# Altium schematic sheet First_Sheet.SCHDOC
size 420 x 297 mm
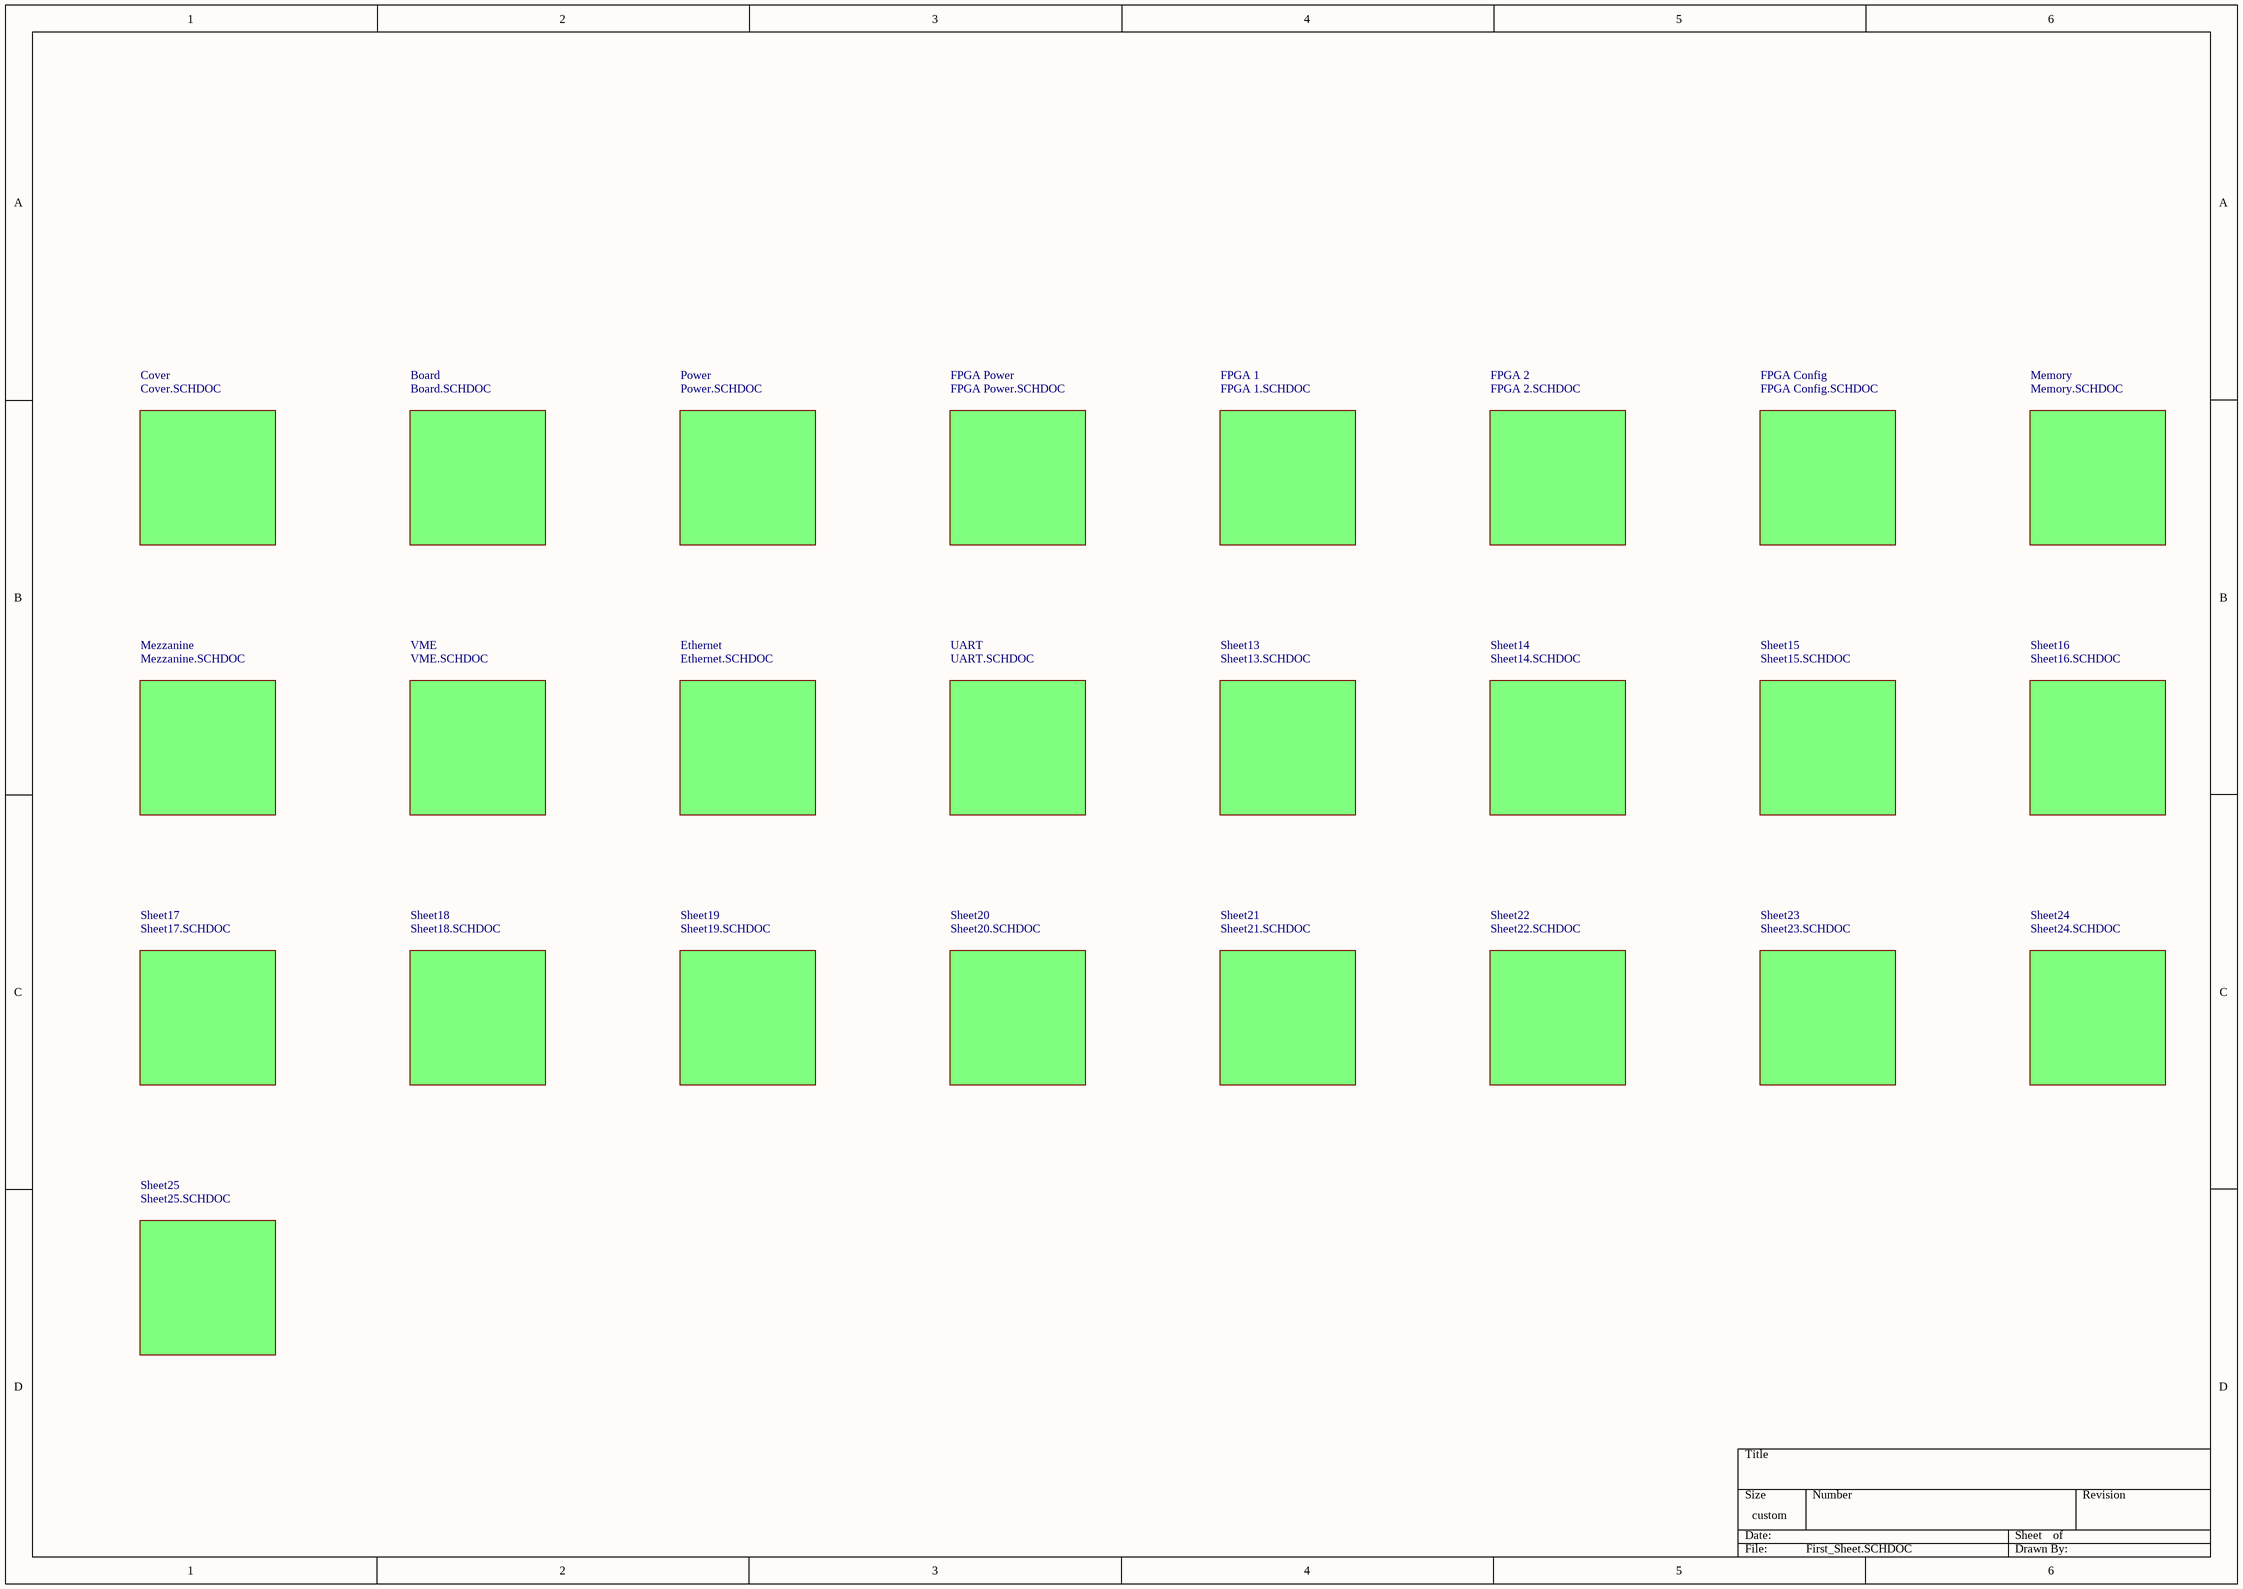
[diagram p0: First_Sheet.SCHDOC]

## Sub-sheets
Board = Board.SCHDOC: no entries
Cover = Cover.SCHDOC: no entries
Ethernet = Ethernet.SCHDOC: no entries
FPGA 1 = FPGA 1.SCHDOC: no entries
FPGA 2 = FPGA 2.SCHDOC: no entries
FPGA Config = FPGA Config.SCHDOC: no entries
FPGA Power = FPGA Power.SCHDOC: no entries
Memory = Memory.SCHDOC: no entries
Mezzanine = Mezzanine.SCHDOC: no entries
Power = Power.SCHDOC: no entries
Sheet13 = Sheet13.SCHDOC: no entries
Sheet14 = Sheet14.SCHDOC: no entries
Sheet15 = Sheet15.SCHDOC: no entries
Sheet16 = Sheet16.SCHDOC: no entries
Sheet17 = Sheet17.SCHDOC: no entries
Sheet18 = Sheet18.SCHDOC: no entries
Sheet19 = Sheet19.SCHDOC: no entries
Sheet20 = Sheet20.SCHDOC: no entries
Sheet21 = Sheet21.SCHDOC: no entries
Sheet22 = Sheet22.SCHDOC: no entries
Sheet23 = Sheet23.SCHDOC: no entries
Sheet24 = Sheet24.SCHDOC: no entries
Sheet25 = Sheet25.SCHDOC: no entries
UART = UART.SCHDOC: no entries
VME = VME.SCHDOC: no entries